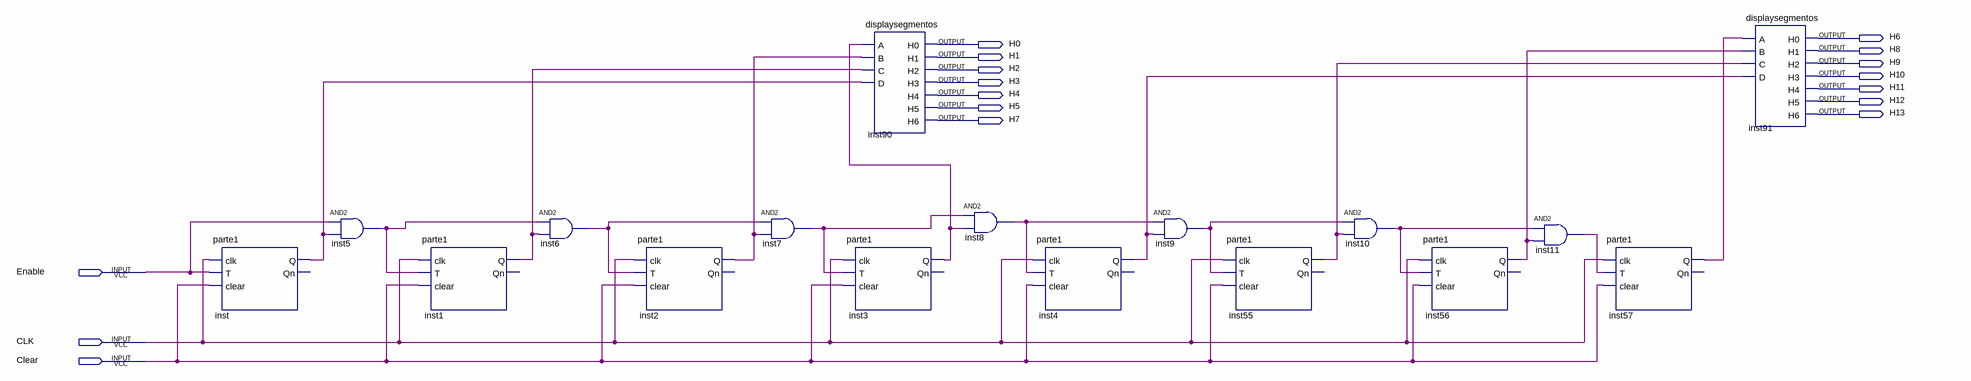
[diagram p0: schematic sheet]
// Quartus schematic contador.bdf as structural Verilog: 17 symbols, 17 pins
module contador (
  input  Enable,
  input  CLK,
  input  Clear,
  output H6,
  output H0,
  output H8,
  output H1,
  output H9,
  output H2,
  output H10,
  output H3,
  output H11,
  output H4,
  output H12,
  output H5,
  output H13,
  output H7
);

  wire inst1_q, inst2_q, inst3_q, inst4_q, inst5_out, inst6_out, inst7_out, inst8_out, inst9_out, inst10_out,
       inst11_out, inst55_q, inst56_q, inst57_q, inst_q;

  parte1 inst (.clk(CLK), .T(Enable), .clear(Clear), .Q(inst_q));  // open: Qn
  and inst5 (inst5_out, Enable, inst_q);
  parte1 inst1 (.clk(CLK), .T(inst5_out), .clear(Clear), .Q(inst1_q));  // open: Qn
  and inst6 (inst6_out, inst5_out, inst1_q);
  parte1 inst2 (.clk(CLK), .T(inst6_out), .clear(Clear), .Q(inst2_q));  // open: Qn
  and inst7 (inst7_out, inst6_out, inst2_q);
  displaysegmentos inst90 (
    .A(inst3_q), .B(inst2_q), .C(inst1_q), .D(inst_q), .H0(H0), .H1(H1), .H2(H2), .H3(H3), .H4(H4), .H5(H5),
    .H6(H7));
  parte1 inst3 (.clk(CLK), .T(inst7_out), .clear(Clear), .Q(inst3_q));  // open: Qn
  and inst8 (inst8_out, inst7_out, inst3_q);
  parte1 inst4 (.clk(CLK), .T(inst8_out), .clear(Clear), .Q(inst4_q));  // open: Qn
  and inst9 (inst9_out, inst8_out, inst4_q);
  parte1 inst55 (.clk(CLK), .T(inst9_out), .clear(Clear), .Q(inst55_q));  // open: Qn
  and inst10 (inst10_out, inst9_out, inst55_q);
  parte1 inst56 (.clk(CLK), .T(inst10_out), .clear(Clear), .Q(inst56_q));  // open: Qn
  and inst11 (inst11_out, inst10_out, inst56_q);
  parte1 inst57 (.clk(CLK), .T(inst11_out), .clear(Clear), .Q(inst57_q));  // open: Qn
  displaysegmentos inst91 (
    .A(inst57_q), .B(inst56_q), .C(inst55_q), .D(inst4_q), .H0(H6), .H1(H8), .H2(H9), .H3(H10), .H4(H11),
    .H5(H12), .H6(H13));
endmodule
